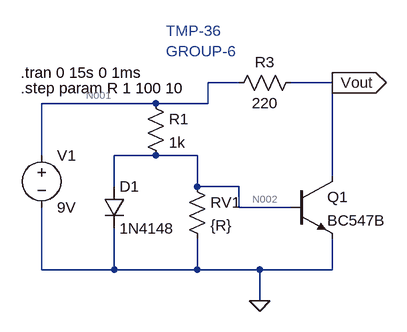
[diagram p0: schematic TMP36-sensor.asc]
TMP36-sensor.asc, the LTspice schematic file:
Version 4
SHEET 1 880 680
WIRE 256 -48 208 -48
WIRE 400 -48 336 -48
WIRE 128 -16 -48 -16
WIRE 208 -16 208 -48
WIRE 208 -16 128 -16
WIRE -48 64 -48 -16
WIRE 128 64 64 64
WIRE 192 64 128 64
WIRE 400 96 400 -48
WIRE 64 112 64 64
WIRE 192 112 192 64
WIRE 256 112 192 112
WIRE 256 144 256 112
WIRE 336 144 256 144
WIRE -48 240 -48 144
WIRE 64 240 64 176
WIRE 64 240 -48 240
WIRE 192 240 192 192
WIRE 192 240 64 240
WIRE 288 240 192 240
WIRE 400 240 400 192
WIRE 400 240 288 240
WIRE 288 288 288 240
FLAG 400 -48 Vout
IOPIN 400 -48 Out
FLAG 288 288 0
SYMBOL voltage -48 48 R0
WINDOW 123 0 0 Left 0
WINDOW 39 0 0 Left 0
SYMATTR InstName V1
SYMATTR Value 9V
SYMBOL res 112 -32 R0
SYMATTR InstName R1
SYMATTR Value 1k
SYMBOL diode 48 112 R0
SYMATTR InstName D1
SYMATTR Value 1N4148
SYMBOL res 176 96 R0
SYMATTR InstName RV1
SYMATTR Value {R}
SYMBOL res 352 -64 R90
WINDOW 0 0 56 VBottom 2
WINDOW 3 32 56 VTop 2
SYMATTR InstName R3
SYMATTR Value 220
SYMBOL npn 336 96 R0
SYMATTR InstName Q1
SYMATTR Value BC547B
TEXT -80 -64 Left 2 !.tran 0 15s 0 1ms
TEXT -80 -40 Left 2 !.step param R 1 100 10
TEXT 144 -128 Left 2 ;TMP-36\nGROUP-6

The netlist it stands for:
* TMP36-sensor.asc
V1 N001 0 9V
R1 N001 N002 1k
D1 N002 0 1N4148
RV1 N002 0 {R}
R3 Vout N001 220
Q1 Vout N002 0 0 BC547B
.model D D
.lib standard.dio
.model NPN NPN
.model PNP PNP
.lib standard.bjt
.tran 0 15s 0 1ms
.step param R 1 100 10
* TMP-36
* GROUP-6
.backanno
.end

* Results of the author's LTspice run, read from the files saved beside the schematic
* Operating Point (first step), zero values left out:
*   r = 1 
*   V(n001) = 9 V
*   V(n002) = 8.991 mV
*   V(vout) = 9 V
*   Ic(Q1) = 9.095 pA
*   Ib(Q1) = -9.047 pA
*   I(D1) = 553.1 pA
*   I(R3) = -9.096 pA
*   I(Rv1) = 8.991 mA
*   I(R1) = 8.991 mA
*   I(V1) = -8.991 mA
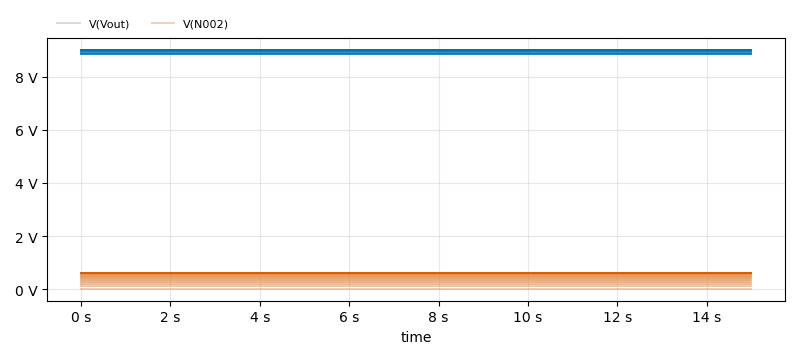
[diagram p1: Transient Analysis of TMP36-sensor.asc, plotted from the saved traces]
* Transient Analysis, 11 runs:
*   V(Vout) [r=1]: min 9 V, max 9 V, average 9 V, rms 9 V, last 9 V
*   V(Vout) [r=11]: min 9 V, max 9 V, average 9 V, rms 9 V, last 9 V
*   V(Vout) [r=21]: min 9 V, max 9 V, average 9 V, rms 9 V, last 9 V
*   V(Vout) [r=31]: min 9 V, max 9 V, average 9 V, rms 9 V, last 9 V
*   V(Vout) [r=41]: min 9 V, max 9 V, average 9 V, rms 9 V, last 9 V
*   V(Vout) [r=51]: min 9 V, max 9 V, average 9 V, rms 9 V, last 9 V
*   V(Vout) [r=61]: min 8.998 V, max 8.998 V, average 8.998 V, rms 8.998 V, last 8.998 V
*   V(Vout) [r=71]: min 8.988 V, max 8.988 V, average 8.988 V, rms 8.988 V, last 8.988 V
*   V(N002) [r=1]: min 8.991 mV, max 8.991 mV, average 8.991 mV, rms 8.991 mV, last 8.991 mV
*   V(N002) [r=11]: min 97.92 mV, max 97.92 mV, average 97.92 mV, rms 97.92 mV, last 97.92 mV
*   V(N002) [r=21]: min 185.1 mV, max 185.1 mV, average 185.1 mV, rms 185.1 mV, last 185.1 mV
*   V(N002) [r=31]: min 270.6 mV, max 270.6 mV, average 270.6 mV, rms 270.6 mV, last 270.6 mV
*   V(N002) [r=41]: min 354.2 mV, max 354.2 mV, average 354.2 mV, rms 354.2 mV, last 354.2 mV
*   V(N002) [r=51]: min 434.9 mV, max 434.9 mV, average 434.9 mV, rms 434.9 mV, last 434.9 mV
*   V(N002) [r=61]: min 507 mV, max 507 mV, average 507 mV, rms 507 mV, last 507 mV
*   V(N002) [r=71]: min 558.9 mV, max 558.9 mV, average 558.9 mV, rms 558.9 mV, last 558.9 mV